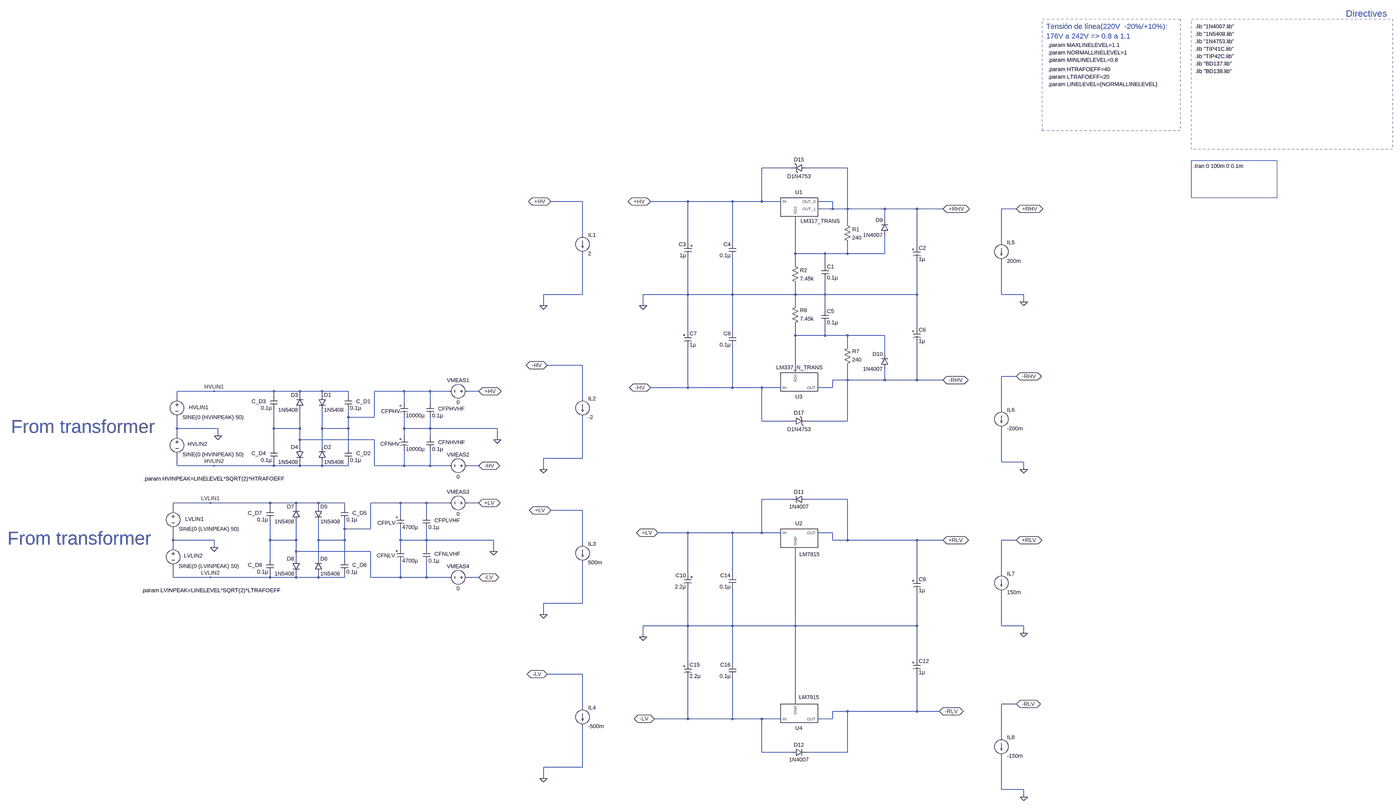
[diagram p0: schematic power_supply_V_1.0c.asc, whole sheet]
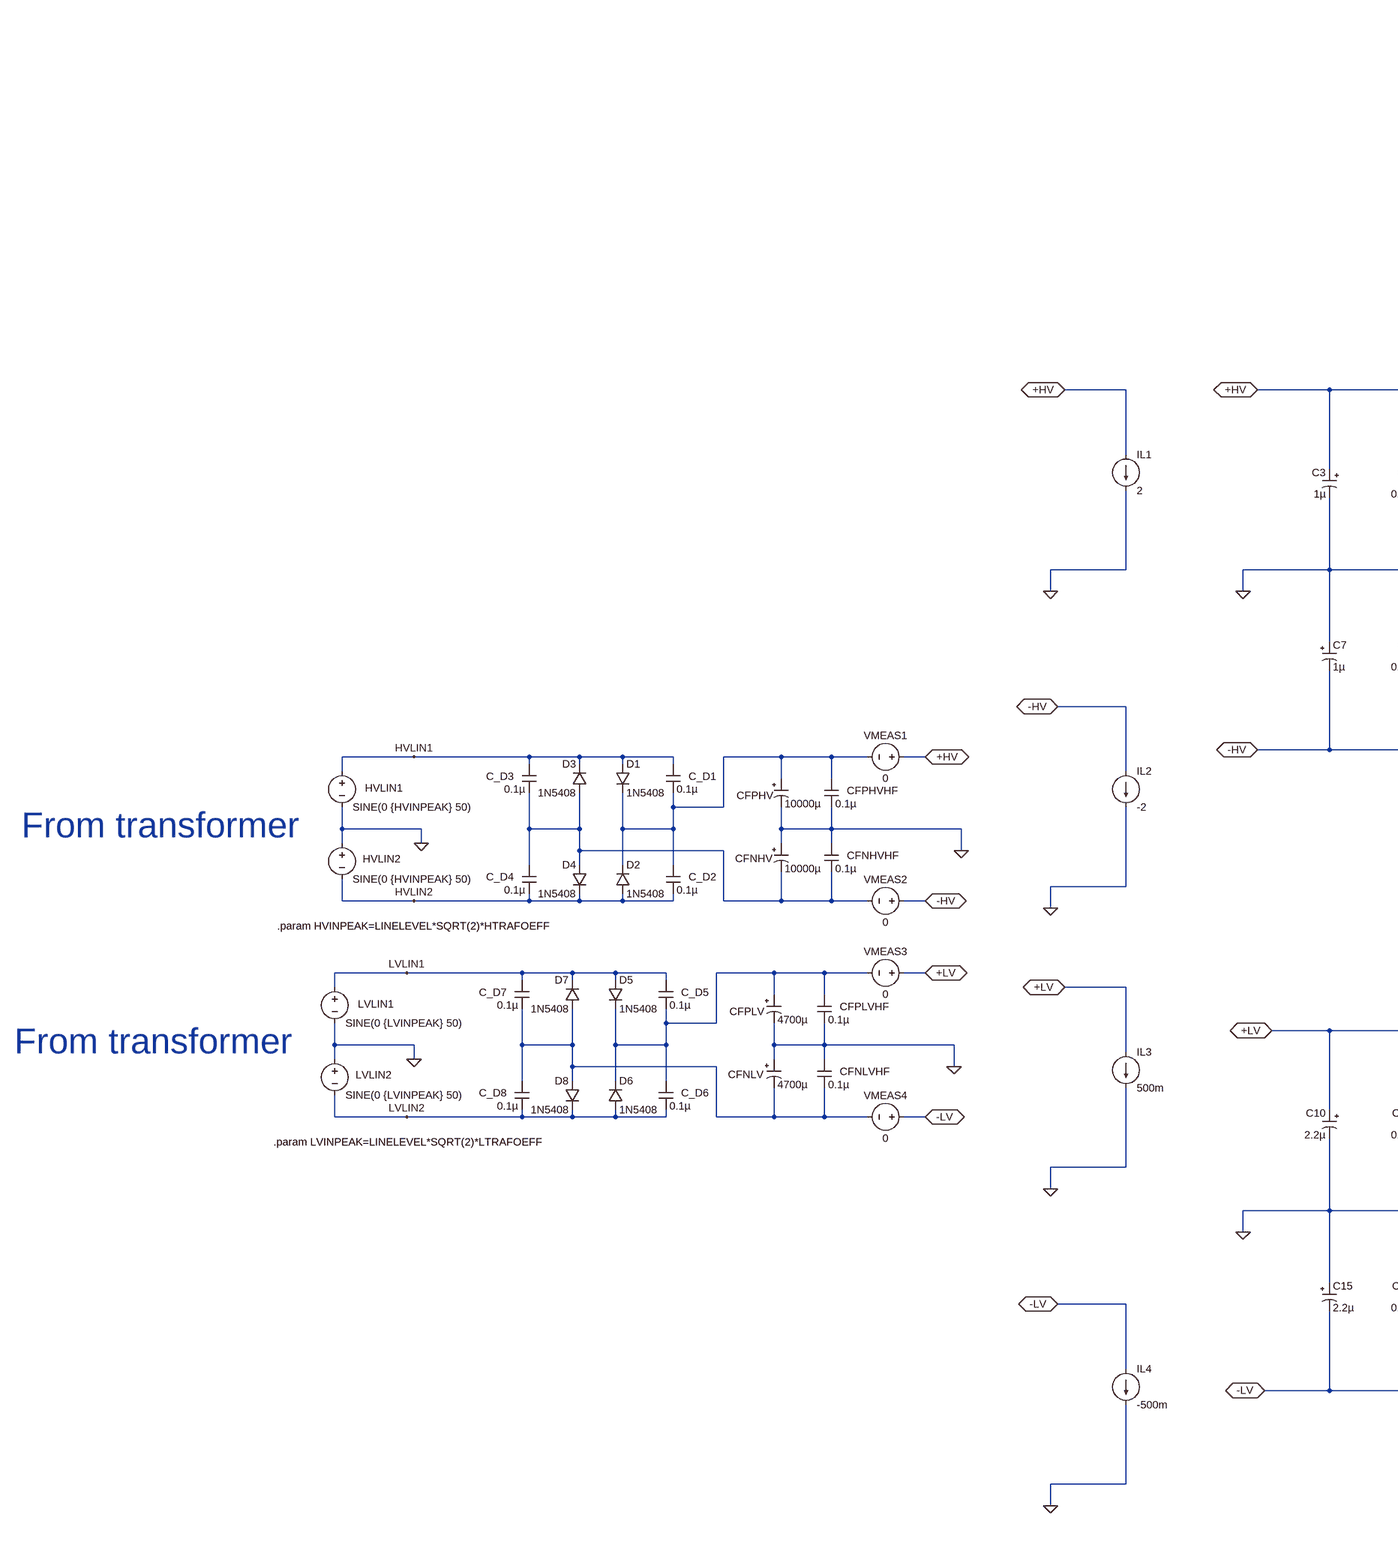
[diagram p1: schematic power_supply_V_1.0c.asc, part, row 1 of 1, column 1 of 2]
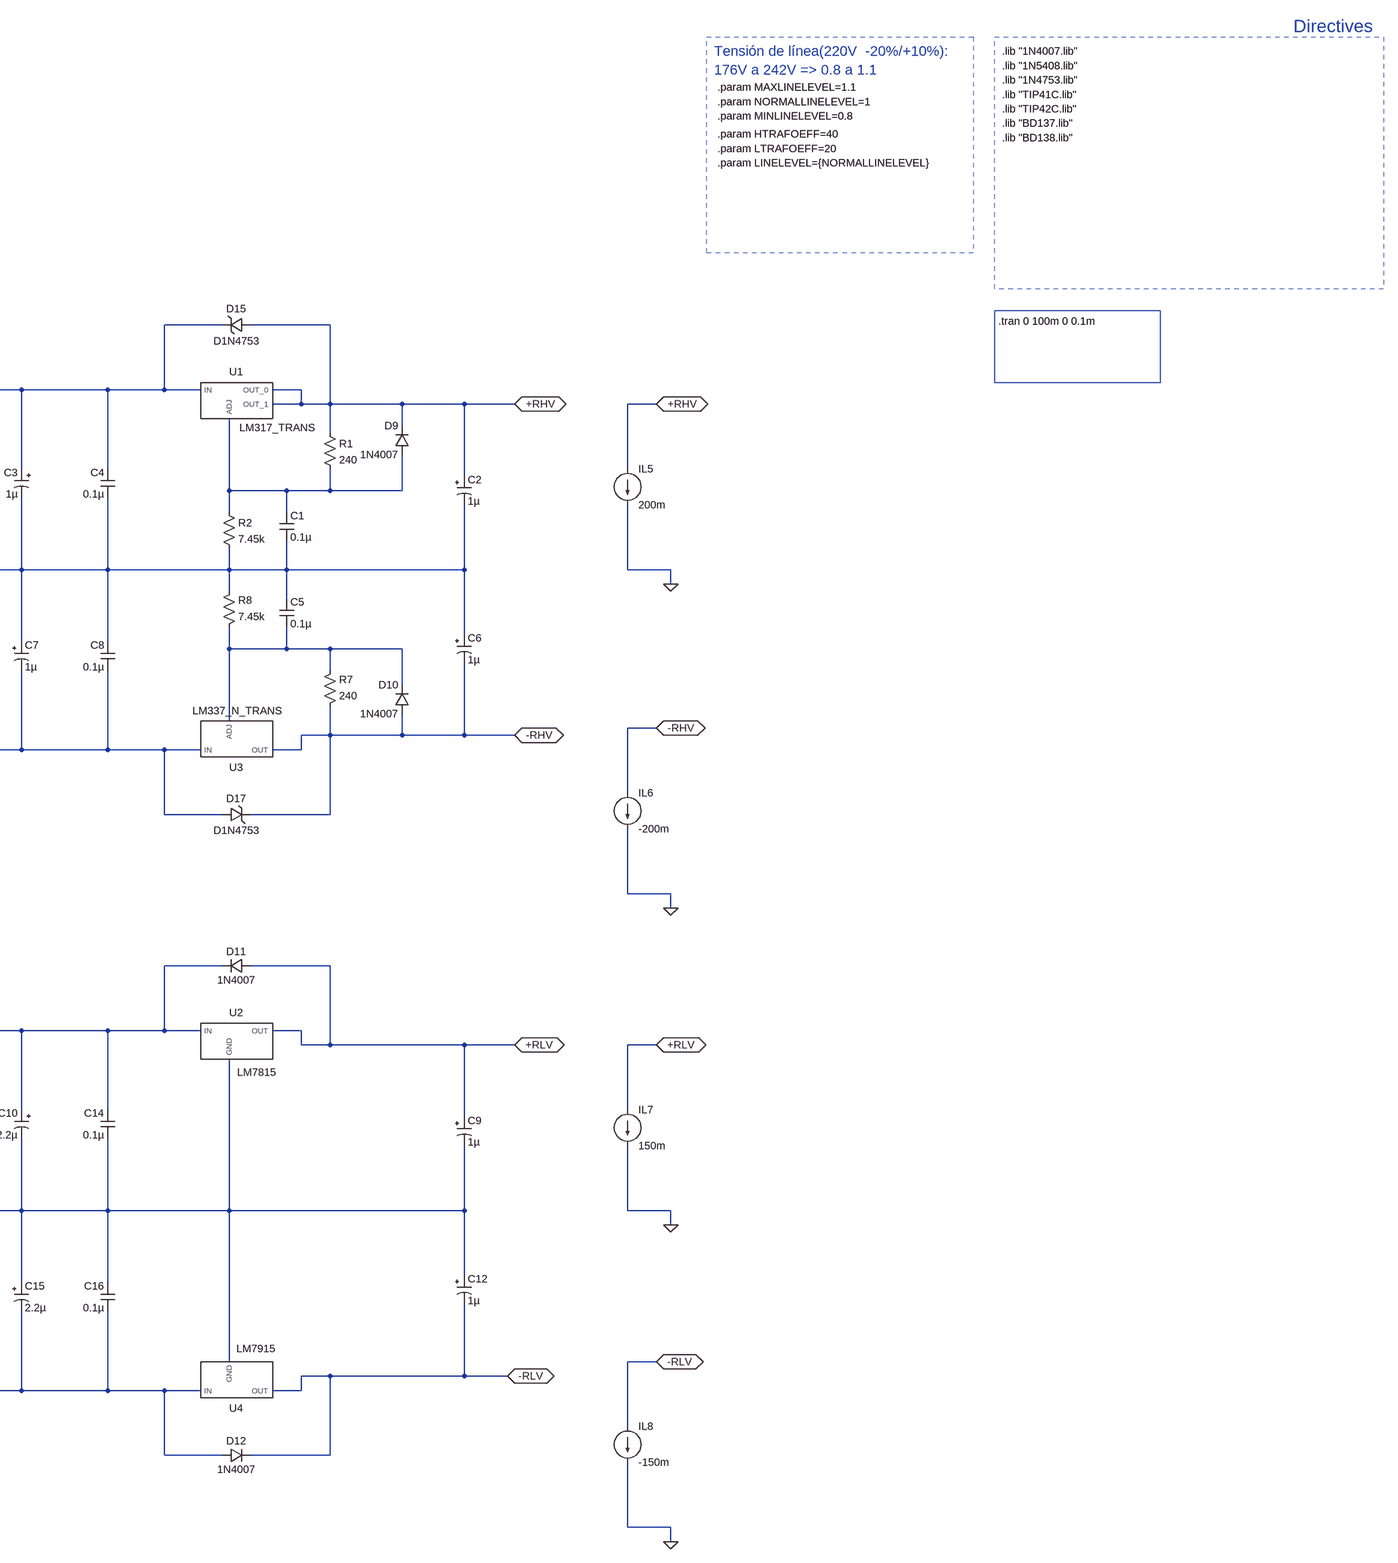
[diagram p2: schematic power_supply_V_1.0c.asc, part, row 1 of 1, column 2 of 2]
power_supply_V_1.0c.asc, the LTspice schematic file:
Version 4
SHEET 1 5728 3116
WIRE 1840 -1056 1712 -1056
WIRE 2080 -1056 1904 -1056
WIRE 704 -912 528 -912
WIRE 1296 -912 1136 -912
WIRE 1488 -912 1296 -912
WIRE 1712 -912 1712 -1056
WIRE 1712 -912 1488 -912
WIRE 1792 -912 1712 -912
WIRE 2016 -912 1952 -912
WIRE 2016 -880 2016 -912
WIRE 2016 -880 1952 -880
WIRE 2080 -880 2080 -1056
WIRE 2080 -880 2016 -880
WIRE 2240 -880 2080 -880
WIRE 2400 -880 2240 -880
WIRE 2512 -880 2400 -880
WIRE 3072 -880 3008 -880
WIRE 2240 -832 2240 -880
WIRE 2080 -816 2080 -880
WIRE 704 -768 704 -912
WIRE 1296 -736 1296 -912
WIRE 1488 -736 1488 -912
WIRE 3008 -736 3008 -880
WIRE 2400 -720 2400 -880
WIRE 1856 -688 1856 -848
WIRE 1984 -688 1856 -688
WIRE 2080 -688 2080 -736
WIRE 2080 -688 1984 -688
WIRE 2240 -688 2240 -768
WIRE 2240 -688 2080 -688
WIRE 1856 -640 1856 -688
WIRE 1984 -640 1984 -688
WIRE 704 -512 704 -688
WIRE 704 -512 496 -512
WIRE 1296 -512 1296 -672
WIRE 1296 -512 1104 -512
WIRE 1488 -512 1488 -672
WIRE 1488 -512 1296 -512
WIRE 1856 -512 1856 -560
WIRE 1856 -512 1488 -512
WIRE 1984 -512 1984 -576
WIRE 1984 -512 1856 -512
WIRE 2400 -512 2400 -656
WIRE 2400 -512 1984 -512
WIRE 3008 -512 3008 -656
WIRE 3104 -512 3008 -512
WIRE 3104 -480 3104 -512
WIRE 496 -464 496 -512
WIRE 1104 -464 1104 -512
WIRE 1856 -464 1856 -512
WIRE 1984 -448 1984 -512
WIRE 2400 -368 2400 -512
WIRE 1296 -352 1296 -512
WIRE 1488 -352 1488 -512
WIRE 1856 -336 1856 -384
WIRE 1984 -336 1984 -384
WIRE 1984 -336 1856 -336
WIRE 2080 -336 1984 -336
WIRE 2240 -336 2080 -336
WIRE 2080 -288 2080 -336
WIRE 2240 -256 2240 -336
WIRE 704 -208 512 -208
WIRE 1856 -176 1856 -336
WIRE 3072 -160 3008 -160
WIRE 2080 -144 2080 -208
WIRE 2080 -144 2016 -144
WIRE 2240 -144 2240 -192
WIRE 2240 -144 2080 -144
WIRE 2400 -144 2400 -304
WIRE 2400 -144 2240 -144
WIRE 2512 -144 2400 -144
WIRE 1296 -112 1296 -288
WIRE 1296 -112 1136 -112
WIRE 1488 -112 1488 -288
WIRE 1488 -112 1296 -112
WIRE 1712 -112 1488 -112
WIRE 1792 -112 1712 -112
WIRE 2016 -112 2016 -144
WIRE 2016 -112 1952 -112
WIRE -1120 -96 -1280 -96
WIRE -864 -96 -1120 -96
WIRE -752 -96 -864 -96
WIRE -656 -96 -752 -96
WIRE -544 -96 -656 -96
WIRE -304 -96 -432 -96
WIRE -192 -96 -304 -96
WIRE -112 -96 -192 -96
WIRE 16 -96 -32 -96
WIRE -864 -80 -864 -96
WIRE -752 -80 -752 -96
WIRE -656 -80 -656 -96
WIRE -544 -80 -544 -96
WIRE -1280 -64 -1280 -96
WIRE 704 -64 704 -208
WIRE -304 -48 -304 -96
WIRE -192 -48 -192 -96
WIRE 3008 -16 3008 -160
WIRE -544 16 -544 -16
WIRE -432 16 -432 -96
WIRE -432 16 -544 16
WIRE 1712 32 1712 -112
WIRE 1840 32 1712 32
WIRE 2080 32 2080 -144
WIRE 2080 32 1904 32
WIRE -1280 64 -1280 16
WIRE -1104 64 -1280 64
WIRE -864 64 -864 -16
WIRE -752 64 -752 -16
WIRE -752 64 -864 64
WIRE -656 64 -656 -16
WIRE -544 64 -544 16
WIRE -544 64 -656 64
WIRE -304 64 -304 16
WIRE -192 64 -192 16
WIRE -192 64 -304 64
WIRE 96 64 -192 64
WIRE -1280 96 -1280 64
WIRE -1104 96 -1104 64
WIRE -304 96 -304 64
WIRE -192 96 -192 64
WIRE -752 112 -752 64
WIRE -432 112 -752 112
WIRE 96 112 96 64
WIRE -864 144 -864 64
WIRE -752 144 -752 112
WIRE -656 144 -656 64
WIRE -544 144 -544 64
WIRE 704 192 704 16
WIRE 704 192 496 192
WIRE 3008 208 3008 64
WIRE 3104 208 3008 208
WIRE -1280 224 -1280 176
WIRE -1120 224 -1280 224
WIRE -864 224 -864 208
WIRE -864 224 -1120 224
WIRE -752 224 -752 208
WIRE -752 224 -864 224
WIRE -656 224 -656 208
WIRE -656 224 -752 224
WIRE -544 224 -544 208
WIRE -544 224 -656 224
WIRE -432 224 -432 112
WIRE -304 224 -304 160
WIRE -304 224 -432 224
WIRE -192 224 -192 160
WIRE -192 224 -304 224
WIRE -112 224 -192 224
WIRE 16 224 -32 224
WIRE 496 240 496 192
WIRE 3104 240 3104 208
WIRE 1840 368 1712 368
WIRE 2080 368 1904 368
WIRE -1136 384 -1296 384
WIRE -880 384 -1136 384
WIRE -768 384 -880 384
WIRE -672 384 -768 384
WIRE -560 384 -672 384
WIRE -320 384 -448 384
WIRE -208 384 -320 384
WIRE -112 384 -208 384
WIRE 16 384 -32 384
WIRE -880 400 -880 384
WIRE -768 400 -768 384
WIRE -672 400 -672 384
WIRE -560 400 -560 384
WIRE -1296 416 -1296 384
WIRE 704 416 528 416
WIRE -320 432 -320 384
WIRE -208 432 -208 384
WIRE -560 496 -560 464
WIRE -448 496 -448 384
WIRE -448 496 -560 496
WIRE 1296 512 1168 512
WIRE 1488 512 1296 512
WIRE 1712 512 1712 368
WIRE 1712 512 1488 512
WIRE 1792 512 1712 512
WIRE 2016 512 1952 512
WIRE -1296 544 -1296 496
WIRE -1120 544 -1296 544
WIRE -880 544 -880 464
WIRE -768 544 -768 464
WIRE -768 544 -880 544
WIRE -672 544 -672 464
WIRE -560 544 -560 496
WIRE -560 544 -672 544
WIRE -320 544 -320 496
WIRE -208 544 -208 496
WIRE -208 544 -320 544
WIRE 80 544 -208 544
WIRE 2016 544 2016 512
WIRE 2080 544 2080 368
WIRE 2080 544 2016 544
WIRE 2400 544 2080 544
WIRE 2512 544 2400 544
WIRE 3072 544 3008 544
WIRE 704 560 704 416
WIRE -1296 576 -1296 544
WIRE -1120 576 -1120 544
WIRE -320 576 -320 544
WIRE -208 576 -208 544
WIRE -768 592 -768 544
WIRE -448 592 -768 592
WIRE 80 592 80 544
WIRE -880 624 -880 544
WIRE -768 624 -768 592
WIRE -672 624 -672 544
WIRE -560 624 -560 544
WIRE 1296 688 1296 512
WIRE 1488 688 1488 512
WIRE 3008 688 3008 544
WIRE -1296 704 -1296 656
WIRE -1136 704 -1296 704
WIRE -880 704 -880 688
WIRE -880 704 -1136 704
WIRE -768 704 -768 688
WIRE -768 704 -880 704
WIRE -672 704 -672 688
WIRE -672 704 -768 704
WIRE -560 704 -560 688
WIRE -560 704 -672 704
WIRE -448 704 -448 592
WIRE -320 704 -320 640
WIRE -320 704 -448 704
WIRE -208 704 -208 640
WIRE -208 704 -320 704
WIRE -112 704 -208 704
WIRE 16 704 -32 704
WIRE 2400 704 2400 544
WIRE 704 816 704 640
WIRE 704 816 496 816
WIRE 496 864 496 816
WIRE 1296 912 1296 752
WIRE 1296 912 1104 912
WIRE 1488 912 1488 752
WIRE 1488 912 1296 912
WIRE 1856 912 1856 576
WIRE 1856 912 1488 912
WIRE 2400 912 2400 768
WIRE 2400 912 1856 912
WIRE 3008 912 3008 768
WIRE 3104 912 3008 912
WIRE 3104 944 3104 912
WIRE 1104 960 1104 912
WIRE 2400 1056 2400 912
WIRE 1296 1072 1296 912
WIRE 1488 1072 1488 912
WIRE 704 1120 512 1120
WIRE 1856 1248 1856 912
WIRE 3072 1248 3008 1248
WIRE 704 1264 704 1120
WIRE 2080 1280 2016 1280
WIRE 2400 1280 2400 1120
WIRE 2400 1280 2080 1280
WIRE 2496 1280 2400 1280
WIRE 1296 1312 1296 1136
WIRE 1296 1312 1152 1312
WIRE 1488 1312 1488 1136
WIRE 1488 1312 1296 1312
WIRE 1712 1312 1488 1312
WIRE 1792 1312 1712 1312
WIRE 2016 1312 2016 1280
WIRE 2016 1312 1952 1312
WIRE 3008 1392 3008 1248
WIRE 1712 1456 1712 1312
WIRE 1840 1456 1712 1456
WIRE 2080 1456 2080 1280
WIRE 2080 1456 1904 1456
WIRE 704 1520 704 1344
WIRE 704 1520 496 1520
WIRE 496 1568 496 1520
WIRE 3008 1616 3008 1472
WIRE 3104 1616 3008 1616
WIRE 3104 1648 3104 1616
FLAG -1120 -96 HVLIN1
FLAG -1120 224 HVLIN2
FLAG -1104 96 0
FLAG 16 -96 +HV
IOPIN 16 -96 BiDir
FLAG 1136 -912 +HV
IOPIN 1136 -912 BiDir
FLAG 16 224 -HV
IOPIN 16 224 BiDir
FLAG 1136 -112 -HV
IOPIN 1136 -112 BiDir
FLAG 1104 -464 0
FLAG 2512 -880 +RHV
IOPIN 2512 -880 BiDir
FLAG 2512 -144 -RHV
IOPIN 2512 -144 BiDir
FLAG 96 112 0
FLAG 1168 512 +LV
IOPIN 1168 512 BiDir
FLAG 1152 1312 -LV
IOPIN 1152 1312 BiDir
FLAG 2512 544 +RLV
IOPIN 2512 544 BiDir
FLAG 2496 1280 -RLV
IOPIN 2496 1280 BiDir
FLAG -1136 384 LVLIN1
FLAG -1136 704 LVLIN2
FLAG -1120 576 0
FLAG 16 384 +LV
IOPIN 16 384 BiDir
FLAG 16 704 -LV
IOPIN 16 704 BiDir
FLAG 528 -912 +HV
IOPIN 528 -912 BiDir
FLAG 496 -464 0
FLAG 512 -208 -HV
IOPIN 512 -208 BiDir
FLAG 496 240 0
FLAG 3072 -880 +RHV
IOPIN 3072 -880 BiDir
FLAG 3104 -480 0
FLAG 3072 -160 -RHV
IOPIN 3072 -160 BiDir
FLAG 3104 240 0
FLAG 3072 544 +RLV
IOPIN 3072 544 BiDir
FLAG 3104 944 0
FLAG 3072 1248 -RLV
IOPIN 3072 1248 BiDir
FLAG 3104 1648 0
FLAG 528 416 +LV
IOPIN 528 416 BiDir
FLAG 496 864 0
FLAG 512 1120 -LV
IOPIN 512 1120 BiDir
FLAG 496 1568 0
FLAG 80 592 0
FLAG 1104 960 0
SYMBOL voltage -1280 -80 R0
WINDOW 123 0 0 Left 2
WINDOW 39 0 0 Left 2
WINDOW 0 51 53 Left 2
SYMATTR InstName HVLIN1
SYMATTR Value SINE(0 {HVINPEAK} 50)
SYMBOL diode -672 -80 R0
SYMATTR InstName D1
SYMATTR Value 1N5408
SYMBOL diode -672 208 M180
WINDOW 0 24 64 Left 2
WINDOW 3 24 0 Left 2
SYMATTR InstName D2
SYMATTR Value 1N5408
SYMBOL polcap -320 -48 R0
WINDOW 0 -83 38 Left 2
WINDOW 3 24 56 Left 2
SYMATTR InstName CFPHV
SYMATTR Value 10000µ
SYMATTR Description Capacitor
SYMATTR Type cap
SYMATTR SpiceLine V=35 Irms=1.45 Rser=0.044 Lser=0 mfg="Nichicon" pn="UPR1V222MRH" type="Al electrolytic"
SYMBOL cap -208 -48 R0
WINDOW 0 50 27 Left 2
SYMATTR InstName CFPHVHF
SYMATTR Value 0.1µ
SYMATTR SpiceLine V=4 Irms=1.62 Rser=0.0464862 Lser=0 mfg="KEMET" pn="C0402C104K7PAC" type="X5R"
SYMBOL diode -736 -16 R180
WINDOW 0 24 64 Left 2
WINDOW 3 24 0 Left 2
SYMATTR InstName D3
SYMATTR Value 1N5408
SYMBOL diode -736 144 M0
SYMATTR InstName D4
SYMATTR Value 1N5408
SYMBOL voltage -1280 80 R0
WINDOW 123 0 0 Left 2
WINDOW 39 0 0 Left 2
WINDOW 0 46 51 Left 2
SYMATTR InstName HVLIN2
SYMATTR Value SINE(0 {HVINPEAK} 50)
SYMBOL polcap -320 96 R0
WINDOW 0 -86 34 Left 2
WINDOW 3 24 56 Left 2
SYMATTR InstName CFNHV
SYMATTR Value 10000µ
SYMATTR Description Capacitor
SYMATTR Type cap
SYMATTR SpiceLine V=35 Irms=1.45 Rser=0.044 Lser=0 mfg="Nichicon" pn="UPR1V222MRH" type="Al electrolytic"
SYMBOL cap -208 96 R0
WINDOW 0 50 27 Left 2
SYMATTR InstName CFNHVHF
SYMATTR Value 0.1µ
SYMATTR SpiceLine V=4 Irms=1.62 Rser=0.0464862 Lser=0 mfg="KEMET" pn="C0402C104K7PAC" type="X5R"
SYMBOL LM317_TRANS 1872 -896 R0
WINDOW 3 91 53 Top 2
SYMATTR InstName U1
SYMBOL diode 2256 -768 R180
WINDOW 0 24 64 Left 2
WINDOW 3 24 0 Left 2
SYMATTR InstName D9
SYMATTR Value 1N4007
SYMBOL res 2064 -832 R0
SYMATTR InstName R1
SYMATTR Value 240
SYMBOL res 1840 -656 R0
SYMATTR InstName R2
SYMATTR Value 7.45k
SYMBOL polcap 2384 -720 R0
SYMATTR InstName C2
SYMATTR Value 1µ
SYMBOL polcap 1312 -736 M0
SYMATTR InstName C3
SYMATTR Value 1µ
SYMBOL diode 2256 -192 R180
WINDOW 0 24 64 Left 2
WINDOW 3 24 0 Left 2
SYMATTR InstName D10
SYMATTR Value 1N4007
SYMBOL res 2064 -192 M180
WINDOW 0 36 76 Left 2
WINDOW 3 36 40 Left 2
SYMATTR InstName R7
SYMATTR Value 240
SYMBOL res 1840 -368 M180
WINDOW 0 36 76 Left 2
WINDOW 3 36 40 Left 2
SYMATTR InstName R8
SYMATTR Value 7.45k
SYMBOL polcap 2384 -368 R0
SYMATTR InstName C6
SYMATTR Value 1µ
SYMBOL LM337_N_TRANS 1872 -128 M180
SYMATTR InstName U3
SYMBOL cap 1968 -640 R0
SYMATTR InstName C1
SYMATTR Value 0.1µ
SYMBOL cap 1504 -736 M0
SYMATTR InstName C4
SYMATTR Value 0.1µ
SYMBOL polcap 1280 -352 R0
SYMATTR InstName C7
SYMATTR Value 1µ
SYMBOL cap 1504 -288 R180
WINDOW 0 24 56 Left 2
WINDOW 3 24 8 Left 2
SYMATTR InstName C8
SYMATTR Value 0.1µ
SYMBOL cap 1968 -384 M180
WINDOW 0 24 56 Left 2
WINDOW 3 24 8 Left 2
SYMATTR InstName C5
SYMATTR Value 0.1µ
SYMBOL cap -560 -80 R0
WINDOW 0 50 27 Left 2
SYMATTR InstName C_D1
SYMATTR Value 0.1µ
SYMATTR SpiceLine V=4 Irms=1.62 Rser=0.0464862 Lser=0 mfg="KEMET" pn="C0402C104K7PAC" type="X5R"
SYMBOL cap -560 144 R0
WINDOW 0 50 27 Left 2
SYMATTR InstName C_D2
SYMATTR Value 0.1µ
SYMATTR SpiceLine V=4 Irms=1.62 Rser=0.0464862 Lser=0 mfg="KEMET" pn="C0402C104K7PAC" type="X5R"
SYMBOL cap -848 -80 M0
WINDOW 0 50 27 Left 2
SYMATTR InstName C_D3
SYMATTR Value 0.1µ
SYMATTR SpiceLine V=4 Irms=1.62 Rser=0.0464862 Lser=0 mfg="KEMET" pn="C0402C104K7PAC" type="X5R"
SYMBOL cap -848 144 M0
WINDOW 0 50 27 Left 2
SYMATTR InstName C_D4
SYMATTR Value 0.1µ
SYMATTR SpiceLine V=4 Irms=1.62 Rser=0.0464862 Lser=0 mfg="KEMET" pn="C0402C104K7PAC" type="X5R"
SYMBOL zener 1904 -1072 R90
WINDOW 0 -4 32 VBottom 2
WINDOW 3 36 32 VTop 2
SYMATTR InstName D15
SYMATTR Value D1N4753
SYMBOL zener 1840 48 R270
WINDOW 0 36 32 VTop 2
WINDOW 3 -4 32 VBottom 2
SYMATTR InstName D17
SYMATTR Value D1N4753
SYMBOL polcap 2384 704 R0
SYMATTR InstName C9
SYMATTR Value 1µ
SYMBOL polcap 1312 688 M0
SYMATTR InstName C10
SYMATTR Value 2.2µ
SYMBOL polcap 2384 1056 R0
SYMATTR InstName C12
SYMATTR Value 1µ
SYMBOL cap 1504 688 M0
SYMATTR InstName C14
SYMATTR Value 0.1µ
SYMBOL polcap 1280 1072 R0
SYMATTR InstName C15
SYMATTR Value 2.2µ
SYMBOL cap 1504 1136 R180
WINDOW 0 24 56 Left 2
WINDOW 3 24 8 Left 2
SYMATTR InstName C16
SYMATTR Value 0.1µ
SYMBOL voltage -1296 400 R0
WINDOW 123 0 0 Left 2
WINDOW 39 0 0 Left 2
WINDOW 0 51 53 Left 2
SYMATTR InstName LVLIN1
SYMATTR Value SINE(0 {LVINPEAK} 50)
SYMBOL diode -688 400 R0
SYMATTR InstName D5
SYMATTR Value 1N5408
SYMBOL diode -688 688 M180
WINDOW 0 24 64 Left 2
WINDOW 3 24 0 Left 2
SYMATTR InstName D6
SYMATTR Value 1N5408
SYMBOL polcap -336 432 R0
WINDOW 0 -83 38 Left 2
WINDOW 3 24 56 Left 2
SYMATTR InstName CFPLV
SYMATTR Value 4700µ
SYMATTR Description Capacitor
SYMATTR Type cap
SYMATTR SpiceLine V=35 Irms=1.45 Rser=0.044 Lser=0 mfg="Nichicon" pn="UPR1V222MRH" type="Al electrolytic"
SYMBOL cap -224 432 R0
WINDOW 0 50 27 Left 2
SYMATTR InstName CFPLVHF
SYMATTR Value 0.1µ
SYMATTR SpiceLine V=4 Irms=1.62 Rser=0.0464862 Lser=0 mfg="KEMET" pn="C0402C104K7PAC" type="X5R"
SYMBOL diode -752 464 R180
WINDOW 0 24 64 Left 2
WINDOW 3 24 0 Left 2
SYMATTR InstName D7
SYMATTR Value 1N5408
SYMBOL diode -752 624 M0
SYMATTR InstName D8
SYMATTR Value 1N5408
SYMBOL voltage -1296 560 R0
WINDOW 123 0 0 Left 2
WINDOW 39 0 0 Left 2
WINDOW 0 46 51 Left 2
SYMATTR InstName LVLIN2
SYMATTR Value SINE(0 {LVINPEAK} 50)
SYMBOL polcap -336 576 R0
WINDOW 0 -86 34 Left 2
WINDOW 3 24 56 Left 2
SYMATTR InstName CFNLV
SYMATTR Value 4700µ
SYMATTR Description Capacitor
SYMATTR Type cap
SYMATTR SpiceLine V=35 Irms=1.45 Rser=0.044 Lser=0 mfg="Nichicon" pn="UPR1V222MRH" type="Al electrolytic"
SYMBOL cap -224 576 R0
WINDOW 0 50 27 Left 2
SYMATTR InstName CFNLVHF
SYMATTR Value 0.1µ
SYMATTR SpiceLine V=4 Irms=1.62 Rser=0.0464862 Lser=0 mfg="KEMET" pn="C0402C104K7PAC" type="X5R"
SYMBOL cap -576 400 R0
WINDOW 0 50 27 Left 2
SYMATTR InstName C_D5
SYMATTR Value 0.1µ
SYMATTR SpiceLine V=4 Irms=1.62 Rser=0.0464862 Lser=0 mfg="KEMET" pn="C0402C104K7PAC" type="X5R"
SYMBOL cap -576 624 R0
WINDOW 0 50 27 Left 2
SYMATTR InstName C_D6
SYMATTR Value 0.1µ
SYMATTR SpiceLine V=4 Irms=1.62 Rser=0.0464862 Lser=0 mfg="KEMET" pn="C0402C104K7PAC" type="X5R"
SYMBOL cap -864 400 M0
WINDOW 0 50 27 Left 2
SYMATTR InstName C_D7
SYMATTR Value 0.1µ
SYMATTR SpiceLine V=4 Irms=1.62 Rser=0.0464862 Lser=0 mfg="KEMET" pn="C0402C104K7PAC" type="X5R"
SYMBOL cap -864 624 M0
WINDOW 0 50 27 Left 2
SYMATTR InstName C_D8
SYMATTR Value 0.1µ
SYMATTR SpiceLine V=4 Irms=1.62 Rser=0.0464862 Lser=0 mfg="KEMET" pn="C0402C104K7PAC" type="X5R"
SYMBOL current 704 -768 R0
WINDOW 123 0 0 Left 0
WINDOW 39 0 0 Left 0
SYMATTR InstName IL1
SYMATTR Value 2
SYMBOL current 704 -64 R0
WINDOW 123 0 0 Left 0
WINDOW 39 0 0 Left 0
SYMATTR InstName IL2
SYMATTR Value -2
SYMBOL current 704 560 R0
WINDOW 123 0 0 Left 0
WINDOW 39 0 0 Left 0
SYMATTR InstName IL3
SYMATTR Value 500m
SYMBOL current 704 1264 R0
WINDOW 123 0 0 Left 0
WINDOW 39 0 0 Left 0
SYMATTR InstName IL4
SYMATTR Value -500m
SYMBOL current 3008 -736 R0
WINDOW 123 0 0 Left 0
WINDOW 39 0 0 Left 0
SYMATTR InstName IL5
SYMATTR Value 200m
SYMBOL current 3008 -16 R0
WINDOW 123 0 0 Left 0
WINDOW 39 0 0 Left 0
SYMATTR InstName IL6
SYMATTR Value -200m
SYMBOL current 3008 688 R0
WINDOW 123 0 0 Left 0
WINDOW 39 0 0 Left 0
SYMATTR InstName IL7
SYMATTR Value 150m
SYMBOL current 3008 1392 R0
WINDOW 123 0 0 Left 0
WINDOW 39 0 0 Left 0
SYMATTR InstName IL8
SYMATTR Value -150m
SYMBOL voltage -16 -96 R90
WINDOW 0 -32 56 VBottom 2
WINDOW 3 32 56 VTop 2
SYMATTR InstName VMEAS1
SYMATTR Value 0
SYMBOL voltage -16 224 R90
WINDOW 0 -32 56 VBottom 2
WINDOW 3 32 56 VTop 2
SYMATTR InstName VMEAS2
SYMATTR Value 0
SYMBOL voltage -16 384 R90
WINDOW 0 -32 56 VBottom 2
WINDOW 3 32 56 VTop 2
SYMATTR InstName VMEAS3
SYMATTR Value 0
SYMBOL voltage -16 704 R90
WINDOW 0 -32 56 VBottom 2
WINDOW 3 32 56 VTop 2
SYMATTR InstName VMEAS4
SYMATTR Value 0
SYMBOL 7815 1872 528 R0
WINDOW 3 46 61 Top 2
SYMATTR InstName U2
SYMBOL 7915 1872 1296 M180
WINDOW 3 44 61 Top 2
SYMATTR InstName U4
SYMBOL diode 1904 352 R90
WINDOW 0 0 32 VBottom 2
WINDOW 3 32 32 VTop 2
SYMATTR InstName D11
SYMATTR Value 1N4007
SYMBOL diode 1840 1472 R270
WINDOW 0 32 32 VTop 2
WINDOW 3 0 32 VBottom 2
SYMATTR InstName D12
SYMATTR Value 1N4007
TEXT -1992 56 Left 6 ;From transformer
TEXT 3832 -1064 Left 2 !.tran 0 100m 0 0.1m
TEXT 3840 -1664 Left 2 !.lib "1N4007.lib"
TEXT 4488 -1720 Left 4 ;Directives
TEXT 3840 -1632 Left 2 !.lib "1N5408.lib"
TEXT 3208 -1480 Left 2 !.param HTRAFOEFF=40
TEXT 3208 -1448 Left 2 !.param LTRAFOEFF=20
TEXT 3208 -1416 Left 2 !.param LINELEVEL={NORMALLINELEVEL}
TEXT 3200 -1664 Left 3 ;Tensión de línea(220V  -20%/+10%):\n176V a 242V => 0.8 a 1.1
TEXT 3208 -1584 Left 2 !.param MAXLINELEVEL=1.1
TEXT 3208 -1520 Left 2 !.param MINLINELEVEL=0.8
TEXT 3208 -1552 Left 2 !.param NORMALLINELEVEL=1
TEXT -1424 280 Left 2 !.param HVINPEAK=LINELEVEL*SQRT(2)*HTRAFOEFF
TEXT -1432 760 Left 2 !.param LVINPEAK=LINELEVEL*SQRT(2)*LTRAFOEFF
TEXT 3840 -1568 Left 2 !.lib "TIP41C.lib"
TEXT 3840 -1536 Left 2 !.lib "TIP42C.lib"
TEXT -2008 536 Left 6 ;From transformer
TEXT 3840 -1504 Left 2 !.lib "BD137.lib"
TEXT 3840 -1472 Left 2 !.lib "BD138.lib"
TEXT 3840 -1600 Left 2 !.lib "1N4753.lib"
RECTANGLE Normal 4688 -1136 3824 -1696 3
RECTANGLE Normal 3776 -1216 3184 -1696 2
RECTANGLE Normal 4192 -928 3824 -1088

The netlist it stands for:
* power_supply_V_1.0c.asc
V§HVLIN1 HVLIN1 0 SINE(0 {HVINPEAK} 50)
D1 HVLIN1 N003 1N5408
D2 HVLIN2 N003 1N5408
CFPHV N003 0 10000µ V=35 Irms=1.45 Rser=0.044 Lser=0 mfg="Nichicon" pn="UPR1V222MRH" type="Al electrolytic"
CFPHVHF N003 0 0.1µ V=4 Irms=1.62 Rser=0.0464862 Lser=0 mfg="KEMET" pn="C0402C104K7PAC" type="X5R"
D3 N004 HVLIN1 1N5408
D4 N004 HVLIN2 1N5408
V§HVLIN2 0 HVLIN2 SINE(0 {HVINPEAK} 50)
CFNHV 0 N004 10000µ V=35 Irms=1.45 Rser=0.044 Lser=0 mfg="Nichicon" pn="UPR1V222MRH" type="Al electrolytic"
CFNHVHF 0 N004 0.1µ V=4 Irms=1.62 Rser=0.0464862 Lser=0 mfg="KEMET" pn="C0402C104K7PAC" type="X5R"
XU1 +HV N001 +RHV +RHV LM317_TRANS  ; pins IN ADJ OUT_0 OUT_1
D9 N001 +RHV 1N4007
R1 +RHV N001 240
R2 N001 0 7.45k
C2 +RHV 0 1µ
C3 +HV 0 1µ
D10 -RHV N002 1N4007
R7 -RHV N002 240
R8 N002 0 7.45k
C6 0 -RHV 1µ
XU3 -HV N002 -RHV LM337_N_TRANS  ; pins IN ADJ OUT
C1 N001 0 0.1µ
C4 +HV 0 0.1µ
C7 0 -HV 1µ
C8 -HV 0 0.1µ
C5 N002 0 0.1µ
C_D1 HVLIN1 N003 0.1µ V=4 Irms=1.62 Rser=0.0464862 Lser=0 mfg="KEMET" pn="C0402C104K7PAC" type="X5R"
C_D2 N003 HVLIN2 0.1µ V=4 Irms=1.62 Rser=0.0464862 Lser=0 mfg="KEMET" pn="C0402C104K7PAC" type="X5R"
C_D3 HVLIN1 N004 0.1µ V=4 Irms=1.62 Rser=0.0464862 Lser=0 mfg="KEMET" pn="C0402C104K7PAC" type="X5R"
C_D4 N004 HVLIN2 0.1µ V=4 Irms=1.62 Rser=0.0464862 Lser=0 mfg="KEMET" pn="C0402C104K7PAC" type="X5R"
D15 +RHV +HV D1N4753
D17 -HV -RHV D1N4753
C9 +RLV 0 1µ
C10 +LV 0 2.2µ
C12 0 -RLV 1µ
C14 +LV 0 0.1µ
C15 0 -LV 2.2µ
C16 -LV 0 0.1µ
V§LVLIN1 LVLIN1 0 SINE(0 {LVINPEAK} 50)
D5 LVLIN1 N005 1N5408
D6 LVLIN2 N005 1N5408
CFPLV N005 0 4700µ V=35 Irms=1.45 Rser=0.044 Lser=0 mfg="Nichicon" pn="UPR1V222MRH" type="Al electrolytic"
CFPLVHF N005 0 0.1µ V=4 Irms=1.62 Rser=0.0464862 Lser=0 mfg="KEMET" pn="C0402C104K7PAC" type="X5R"
D7 N006 LVLIN1 1N5408
D8 N006 LVLIN2 1N5408
V§LVLIN2 0 LVLIN2 SINE(0 {LVINPEAK} 50)
CFNLV 0 N006 4700µ V=35 Irms=1.45 Rser=0.044 Lser=0 mfg="Nichicon" pn="UPR1V222MRH" type="Al electrolytic"
CFNLVHF 0 N006 0.1µ V=4 Irms=1.62 Rser=0.0464862 Lser=0 mfg="KEMET" pn="C0402C104K7PAC" type="X5R"
C_D5 LVLIN1 N005 0.1µ V=4 Irms=1.62 Rser=0.0464862 Lser=0 mfg="KEMET" pn="C0402C104K7PAC" type="X5R"
C_D6 N005 LVLIN2 0.1µ V=4 Irms=1.62 Rser=0.0464862 Lser=0 mfg="KEMET" pn="C0402C104K7PAC" type="X5R"
C_D7 LVLIN1 N006 0.1µ V=4 Irms=1.62 Rser=0.0464862 Lser=0 mfg="KEMET" pn="C0402C104K7PAC" type="X5R"
C_D8 N006 LVLIN2 0.1µ V=4 Irms=1.62 Rser=0.0464862 Lser=0 mfg="KEMET" pn="C0402C104K7PAC" type="X5R"
IL1 +HV 0 2
IL2 -HV 0 -2
IL3 +LV 0 500m
IL4 -LV 0 -500m
IL5 +RHV 0 200m
IL6 -RHV 0 -200m
IL7 +RLV 0 150m
IL8 -RLV 0 -150m
VMEAS1 +HV N003 0
VMEAS2 -HV N004 0
VMEAS3 +LV N005 0
VMEAS4 -LV N006 0
XU2 +LV 0 +RLV LM7815  ; pins IN GND OUT
XU4 -LV 0 -RLV LM7915  ; pins IN GND OUT
D11 +RLV +LV 1N4007
D12 -LV -RLV 1N4007
.model D D
.lib standard.dio
* From transformer
.tran 0 100m 0 0.1m
.lib "1N4007.lib"
* Directives
.lib "1N5408.lib"
.param HTRAFOEFF=40
.param LTRAFOEFF=20
.param LINELEVEL={NORMALLINELEVEL}
* Tensión de línea(220V  -20%/+10%):
* 176V a 242V => 0.8 a 1.1
.param MAXLINELEVEL=1.1
.param MINLINELEVEL=0.8
.param NORMALLINELEVEL=1
.param HVINPEAK=LINELEVEL*SQRT(2)*HTRAFOEFF
.param LVINPEAK=LINELEVEL*SQRT(2)*LTRAFOEFF
.lib "TIP41C.lib"
.lib "TIP42C.lib"
* From transformer
.lib "BD137.lib"
.lib "BD138.lib"
.lib "1N4753.lib"
.lib LM317_TRANS.LIB
.lib LM337_N_TRANS.LIB
.lib LM7815.lib
.lib LM7915.lib
.backanno
.end